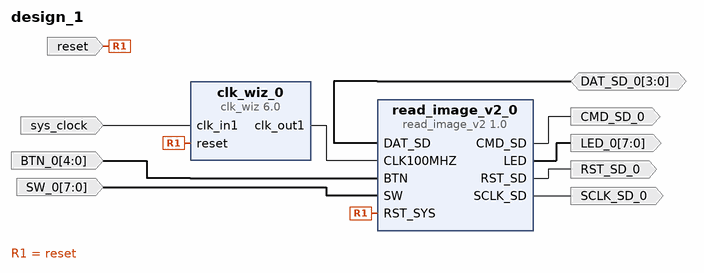
[diagram p0: block diagram of the top level]
# Vivado block design design_1, xc7a200tsbg484-1, Vivado 2018.3
create_bd_design design_1

create_bd_port -dir I -from 4 -to 0 BTN_0
create_bd_port -dir I -from 7 -to 0 SW_0
create_bd_port -dir IO -from 3 -to 0 DAT_SD_0
create_bd_port -dir O RST_SD_0
create_bd_port -dir O CMD_SD_0
create_bd_port -dir O SCLK_SD_0
create_bd_port -dir O -from 7 -to 0 LED_0
create_bd_port -dir I -type rst reset
set_property -dict {CONFIG.POLARITY ACTIVE_LOW} [get_bd_ports reset]
create_bd_port -dir I -type clk sys_clock
set_property -dict {CONFIG.FREQ_HZ 100000000 CONFIG.PHASE 0.000} [get_bd_ports sys_clock]

create_bd_cell -type ip -vlnv user.org:user:read_image_v2:1.0 read_image_v2_0
create_bd_cell -type ip -vlnv xilinx.com:ip:clk_wiz:6.0 clk_wiz_0
set_property -dict [list \
  CONFIG.CLK_IN1_BOARD_INTERFACE sys_clock \
  CONFIG.RESET_BOARD_INTERFACE reset \
  CONFIG.USE_BOARD_FLOW true \
] [get_bd_cells clk_wiz_0]

# ---- connections ----

connect_bd_net [get_bd_pins clk_wiz_0/clk_out1] [get_bd_pins read_image_v2_0/CLK100MHZ]
connect_bd_net -net BTN_0_1 [get_bd_ports BTN_0] [get_bd_pins read_image_v2_0/BTN]
connect_bd_net -net SW_0_1 [get_bd_ports SW_0] [get_bd_pins read_image_v2_0/SW]
connect_bd_net [get_bd_ports DAT_SD_0] [get_bd_pins read_image_v2_0/DAT_SD]
connect_bd_net [get_bd_pins read_image_v2_0/RST_SD] [get_bd_ports RST_SD_0]
connect_bd_net [get_bd_pins read_image_v2_0/CMD_SD] [get_bd_ports CMD_SD_0]
connect_bd_net [get_bd_pins read_image_v2_0/SCLK_SD] [get_bd_ports SCLK_SD_0]
connect_bd_net [get_bd_pins read_image_v2_0/LED] [get_bd_ports LED_0]
connect_bd_net [get_bd_ports reset] [get_bd_pins clk_wiz_0/reset] [get_bd_pins read_image_v2_0/RST_SYS]
connect_bd_net [get_bd_ports sys_clock] [get_bd_pins clk_wiz_0/clk_in1]

validate_bd_design
save_bd_design
